# Altium schematic sheet MOSFETs.SchDoc
size A4
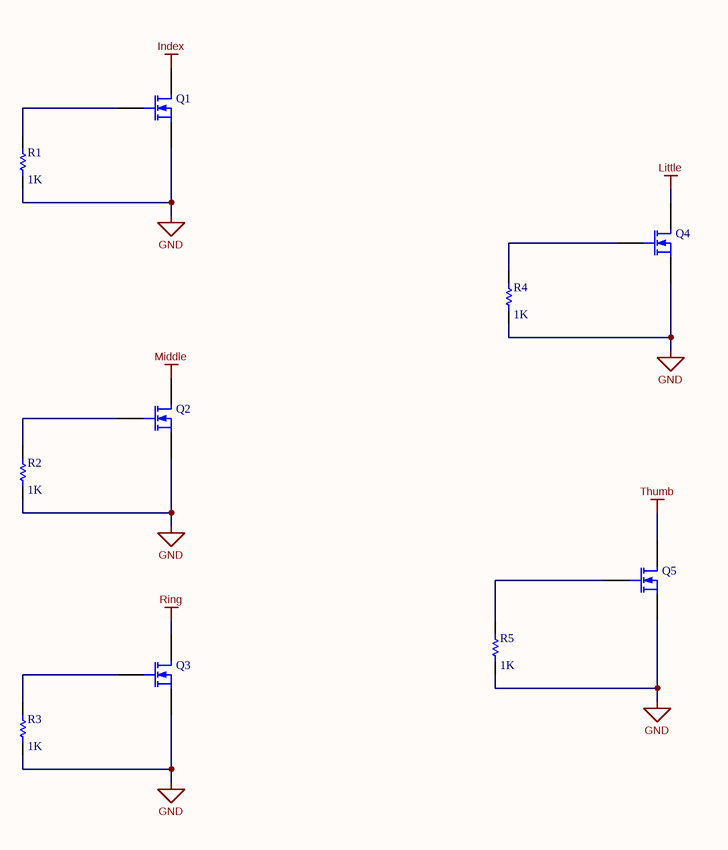
[diagram p0: MOSFETs.SchDoc]

## Parts
Q1  MOSFET-N  [E3]  (value not drawn)
Q2  MOSFET-N  [E3]  (value not drawn)
Q3  MOSFET-N  [E3]  (value not drawn)
Q4  MOSFET-N  [E3]  (value not drawn)
Q5  MOSFET-N  [E3]  (value not drawn)
R1  value 1K  [AXIAL-0.3]  (hidden comment: Res1)
R2  value 1K  [AXIAL-0.3]  (hidden comment: Res1)
R3  value 1K  [AXIAL-0.3]  (hidden comment: Res1)
R4  value 1K  [AXIAL-0.3]  (hidden comment: Res1)
R5  value 1K  [AXIAL-0.3]  (hidden comment: Res1)

## Nets
GND: Q1.3(S) Q2.3(S) Q3.3(S) Q4.3(S) Q5.3(S) R1.1 R2.1 R3.1 R4.1 R5.1
Index: Q1.1(D)
Little: Q4.1(D)
Middle: Q2.1(D)
Ring: Q3.1(D)
Thumb: Q5.1(D)
NetQ1_2: Q1.2(G) R1.2
NetQ2_2: Q2.2(G) R2.2
NetQ3_2: Q3.2(G) R3.2
NetQ4_2: Q4.2(G) R4.2
NetQ5_2: Q5.2(G) R5.2

## Library data of the parts
Q1-Q5 = MOSFET-N: N-Channel MOSFET; Published: 8-Jun-2000; LatestRevisionDate: 17-Jul-2002; LatestRevisionNote: Re-released for DXP Platform.; PackageVersion: 1995/1996; PackageReference: E3; Publisher: Altium Limited; PackageDescription: TO, Flat Index; 3 In-Line, Axial Leads; Body Dia. 4.6mm; Lead Dia. 0.5 mm (max)
R1-R5 = Res1: Resistor; Published: 8-Jun-2000; LatestRevisionDate: 17-Jul-2002; LatestRevisionNote: Re-released for DXP Platform.; PackageReference: AXIAL-0.3; Publisher: Altium Limited; PackageDescription: Axial Device, Thru-Hole; 2 Leads; 0.3 in Pin Spacing